# EAGLE design Schematics1 (EAGLE 6.5.0)
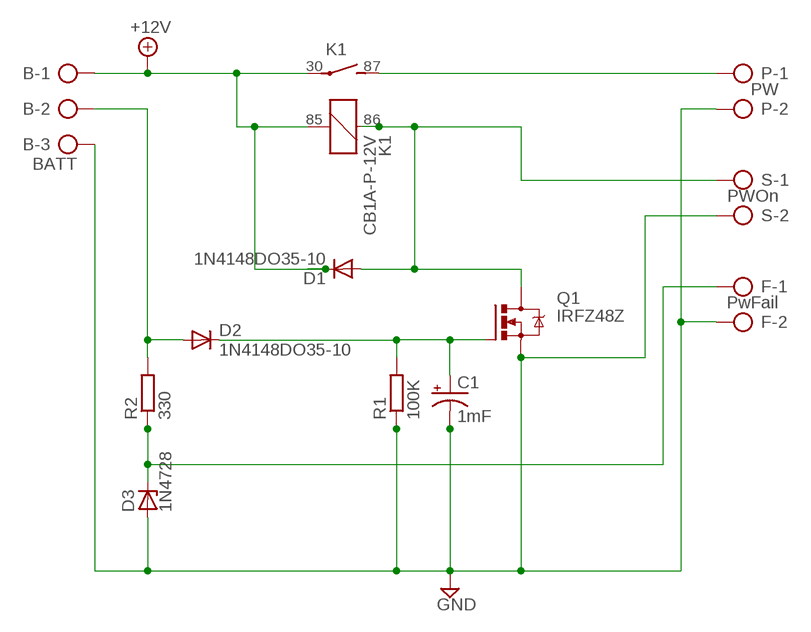
[diagram p0: schematic, sheet 1]

## Parts
B  BATT  AK300/3  [AK300/3]
C1  1mF  CPOL-USE10-20  [EB20D]
D1  1N4148DO35-10  [DO35-10]
D2  1N4148DO35-10  [DO35-10]
D3  1N4728  [DO41Z10]
F  PwFail  AK300/2  [AK300/2]
K1  CB1A-P-12V  [CB1]
P  PW  AK300/2  [AK300/2]
Q1  IRFZ48Z  [TO220BH]
R1  100K  R-EU_0207/12  [0207/12]
R2  330  R-EU_0207/12  [0207/12]
S  PWOn  AK300/2  [AK300/2]

## Nets
+12V: B.1 D1.C K1.30(2:P) K1.85
GND: B.3 C1.- D3.A F.2 P.2 Q1.S R1.1 S.2
N$2: D3.C F.1 R2.1
N$4: C1.+ D2.C Q1.G R1.2
N$5: B.2 D2.A R2.2
N$6: K1.87(2:S) P.1
N$8: D1.A K1.86 Q1.D S.1

## Library data of the parts
B = con-ptr500:AK300/3: CONNECTOR; OC_FARNELL: unknown; OC_NEWARK: unknown
C1 = rcl:CPOL-US: POLARIZED CAPACITOR, American symbol
D1 D2 = diode:1N4148: DIODE high speed (Philips)
D3 = diode:1N4728: Z DIODE 3.3 V, 1W, 5 percent
F P S = con-ptr500:AK300/2: CONNECTOR; OC_FARNELL: unknown; OC_NEWARK: unknown
K1 = relay:CB*: HIGH POWER AUTOMOTIVE RELAY Form A NAiS Source: http://www.mew-europe.com/.. en_ds_61202_0000.pdf; MF: AROMAT/ MATSUSHITA; MPN: CB1A-P-12V; OC_FARNELL: 1270582; OC_NEWARK: 50B849
Q1 = transistor-power:IRFZ48: N Channel HEXFET® Power MOSFET Logic Level Source: http://www.irf.com/product-info/datasheets/data/irfz48z.pdf
R1 R2 = rcl:R-EU_: RESISTOR, European symbol

## Board
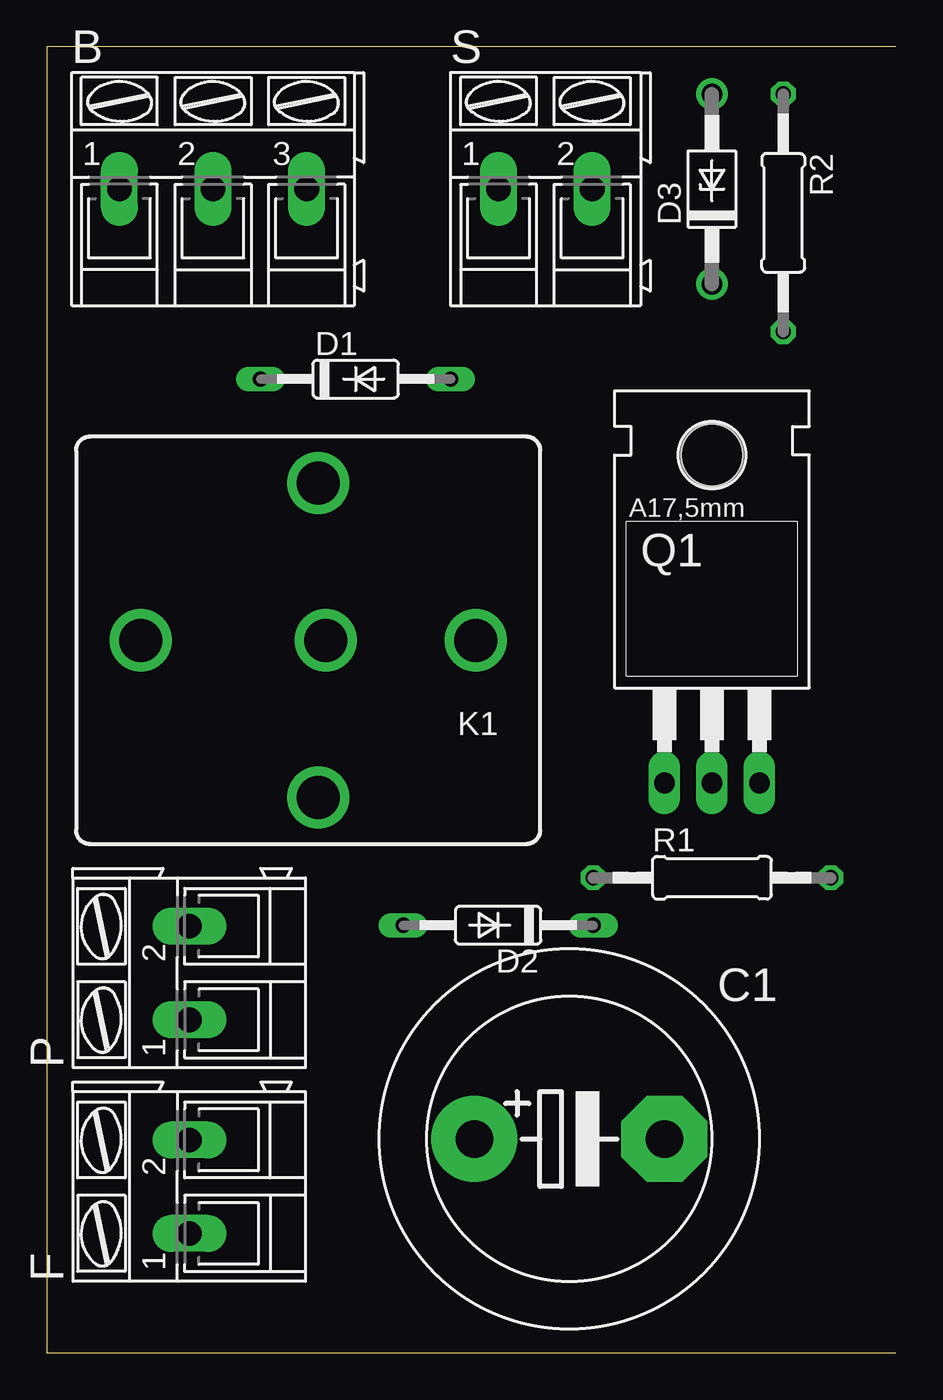
[diagram p1: board, top side]
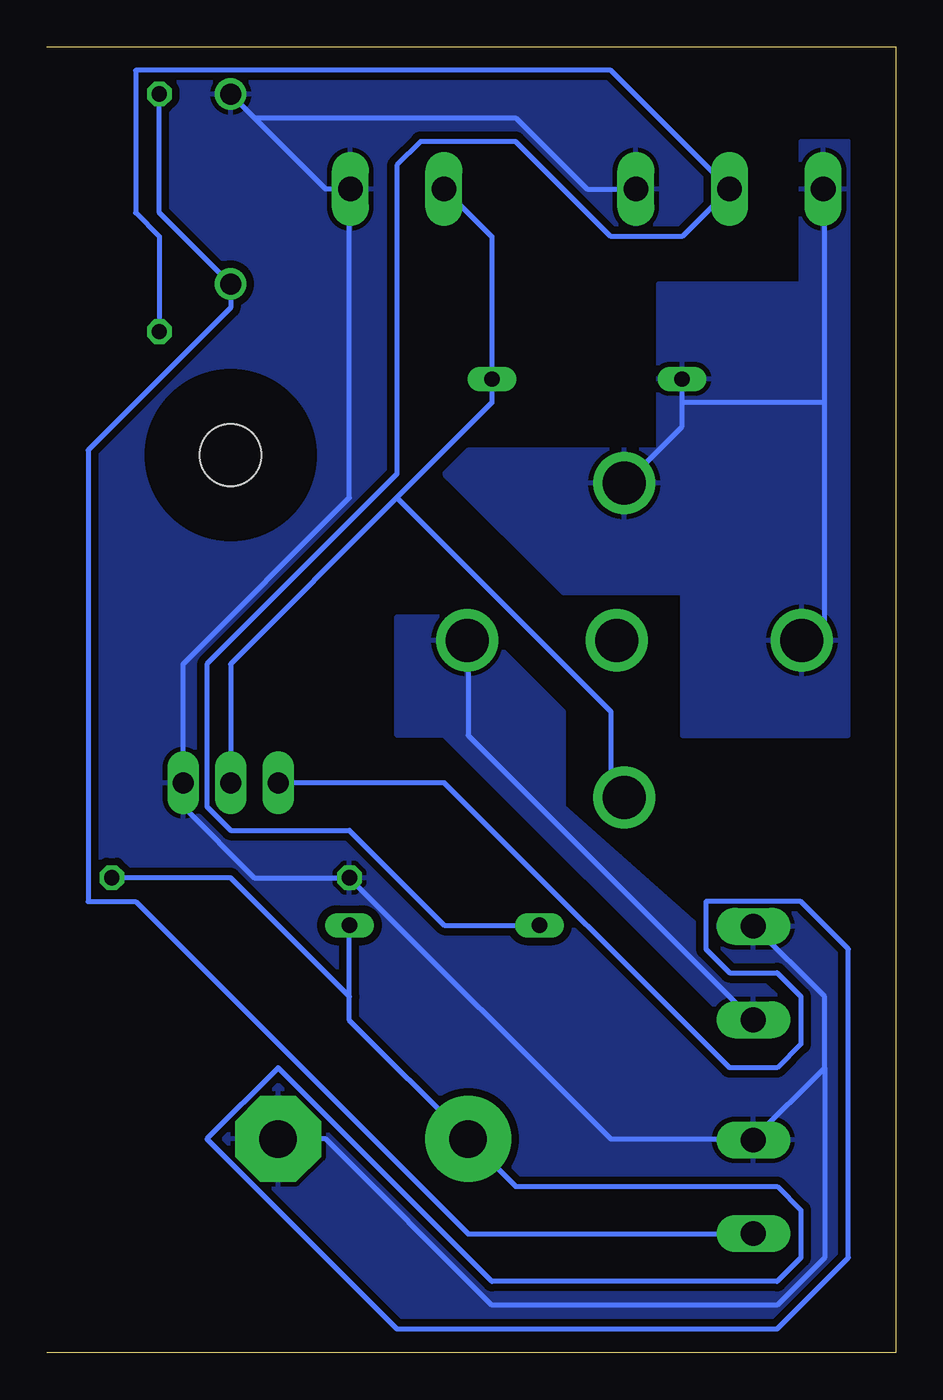
[diagram p2: board, bottom side, seen from below]

Size 45.39 x 69.84 mm. Coordinates in mm from the lower left corner, seen from the top.
Outline: 45.39,0 0,0 0,69.84 45.39,69.84
Copper layers (1*16): Top 0.035mm / dielectric 1.5mm / Bottom 0.035mm
Design rules "default *": minimum track width 15mil, minimum drill 24mil, track to track 8mil, track to pad 8mil, pad to pad 8mil, via to via 8mil, smd to smd 8mil, copper to edge 40mil, drill to drill 8mil, minimum pad ring 10mil, minimum via ring 8mil, stop-mask expansion 4mil, vias tented up to drill 0mil, thermal gap 10mil

### Footprints (pad centres in the part's own frame; a part is rotated, then mirrored left to right if it is on the bottom)
AK300/3 = drill 1.321 long: 1 -5.004,0; 2 0,0; 3 5.004,0
EB20D = drill 2.007 pad 4.597: + -5.08,0 | drill 2.007 pad 4.597 octagon: - 5.08,0
DO35-10 = drill 0.813 long: A 5.08,0; C -5.08,0
DO41Z10 = drill 1.118: A 5.08,0; C -5.08,0
AK300/2 = drill 1.321 long: 1 -2.515,0; 2 2.489,0
CB1 = drill 2.3: 30 8.95,0; 85 -0.55,-8.4; 86 -0.55,8.4; 87 -8.95,0; 87A -0.95,0
TO220BH = drill 1.118 long: D 0,-6.35; G -2.54,-6.35; S 2.54,-6.35 | hole 3.302: 0,11.176
0207/12 = drill 0.813 octagon: 1 -6.35,0; 2 6.35,0

### Placement (x,y rotation side)
B  8.89,62.23 0 top
C1  27.94,11.43 0 top
D1  16.51,52.07 0 top
D2  24.13,22.86 180 top
D3  35.56,62.23 90 top
F  7.62,8.89 90 top
K1  13.97,38.1 180 top
P  7.62,20.32 90 top
Q1  35.56,36.83 0 top
R1  35.56,25.4 0 top
R2  39.37,60.96 270 top
S  26.67,62.23 0 top

### Tracks (layer width: path | path; a pad name or v marks a point on that pad's centre or on a via)
+12V
  Bottom 0.254: 11.43,50.8 11.43,49.53 13.97,46.99 K1.85 | 11.43,50.8 D1.C | 3.81,50.8 3.81,38.1 K1.30 | 3.81,50.8 3.81,62.23 B.1 | 3.81,50.8 11.43,50.8
  pour Bottom (isolate 0.406): 2.54,64.77 5.08,64.77 5.08,57.15 11.43,57.15 12.7,57.15 12.7,48.26 22.86,48.26 24.13,46.99 17.78,40.64 11.43,40.64 11.43,33.02 2.54,33.02
GND
  Bottom 0.254: 34.29,66.04 30.48,62.23 29.21,62.23 | 34.29,66.04 D3.A | B.3 16.51,62.23 20.32,66.04 34.29,66.04 | 7.62,11.43 15.24,11.43 R1.1 34.29,25.4 38.1,29.21 Q1.S 38.1,36.83 29.21,45.72 29.21,62.23 | 3.81,15.24 3.81,19.05 7.62,22.86 P.2 | 7.62,11.43 3.81,15.24 | 7.62,11.43 F.2 | C1.- 30.48,11.43 21.59,2.54 6.35,2.54 3.81,5.08 3.81,15.24 | 29.21,62.23 S.2
  pour Bottom (isolate 0.406): 0,69.85 45.72,69.85 45.72,64.77 45.72,0 0,0
N$2
  Bottom 0.254: R2.1 39.37,60.96 D3.C 35.56,55.88 43.18,48.26 43.18,24.13 40.64,24.13 22.86,6.35 7.62,6.35 F.1
N$4
  Bottom 0.254: 29.21,19.05 29.21,17.78 C1.+ 20.32,8.89 6.35,8.89 5.08,7.62 5.08,5.08 6.35,3.81 21.59,3.81 33.02,15.24 36.83,11.43 26.67,1.27 6.35,1.27 2.54,5.08 2.54,21.59 5.08,24.13 10.16,24.13 10.16,21.59 8.89,20.32 6.35,20.32 5.08,19.05 5.08,16.51 6.35,15.24 8.89,15.24 24.13,30.48 Q1.G | 29.21,19.05 D2.C | R1.2 35.56,25.4 29.21,19.05
N$5
  Bottom 0.254: D2.A 24.13,22.86 29.21,27.94 35.56,27.94 36.83,29.21 36.83,36.83 26.67,46.99 26.67,63.5 25.4,64.77 20.32,64.77 15.24,59.69 11.43,59.69 B.2 15.24,68.58 40.64,68.58 40.64,60.96 39.37,59.69 R2.2
N$6
  Bottom 0.254: P.1 7.62,17.78 22.86,33.02 22.86,38.1 K1.87
  pour Bottom (isolate 0.406): 6.35,19.05 6.35,17.78 8.89,17.78 24.13,33.02 26.67,33.02 26.67,39.37 22.86,39.37 17.78,34.29 17.78,29.21
N$8
  Bottom 0.254: S.1 24.13,62.23 21.59,59.69 D1.A 21.59,50.8 26.67,45.72 | Q1.D 35.56,36.83 26.67,45.72 | 26.67,45.72 15.24,34.29 15.24,30.48 K1.86